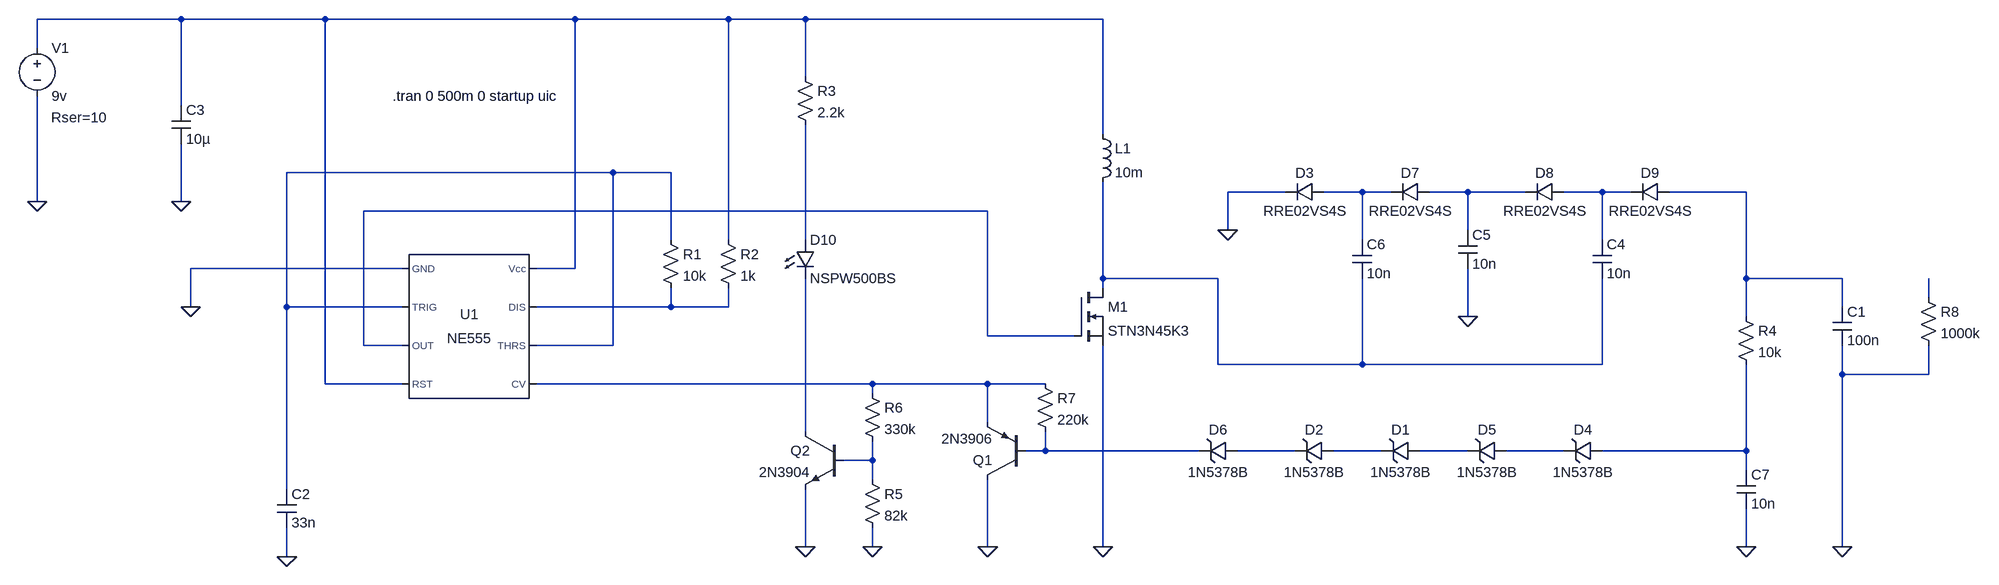
[diagram p0: schematic hv-power-supply-minus-450v.asc]
hv-power-supply-minus-450v.asc, the LTspice schematic file:
Version 4
SHEET 1 3732 680
WIRE -320 -352 -560 -352
WIRE -80 -352 -320 -352
WIRE 336 -352 -80 -352
WIRE 592 -352 336 -352
WIRE 720 -352 592 -352
WIRE 1216 -352 720 -352
WIRE -560 -304 -560 -352
WIRE 720 -256 720 -352
WIRE -320 -208 -320 -352
WIRE 1216 -160 1216 -352
WIRE 400 -96 -144 -96
WIRE 496 -96 400 -96
WIRE 1520 -64 1424 -64
WIRE 1648 -64 1584 -64
WIRE 1696 -64 1648 -64
WIRE 1824 -64 1760 -64
WIRE 1920 -64 1824 -64
WIRE 2048 -64 1984 -64
WIRE 2096 -64 2048 -64
WIRE 2288 -64 2160 -64
WIRE -560 -48 -560 -224
WIRE -320 -48 -320 -144
WIRE 1024 -32 -16 -32
WIRE 1424 0 1424 -64
WIRE 1824 0 1824 -64
WIRE 496 16 496 -96
WIRE 592 16 592 -352
WIRE 720 16 720 -176
WIRE 1648 16 1648 -64
WIRE 2048 16 2048 -64
WIRE 48 64 -304 64
WIRE 336 64 336 -352
WIRE 336 64 272 64
WIRE 1216 80 1216 -80
WIRE 1408 80 1216 80
WIRE 2288 80 2288 -64
WIRE 2448 80 2288 80
WIRE 1216 96 1216 80
WIRE 2592 112 2592 80
WIRE -304 128 -304 64
WIRE -144 128 -144 -96
WIRE 48 128 -144 128
WIRE 496 128 496 96
WIRE 496 128 272 128
WIRE 592 128 592 96
WIRE 592 128 496 128
WIRE 2448 128 2448 80
WIRE 1824 144 1824 64
WIRE 2288 144 2288 80
WIRE 1024 176 1024 -32
WIRE 1168 176 1024 176
WIRE -16 192 -16 -32
WIRE 48 192 -16 192
WIRE 400 192 400 -96
WIRE 400 192 272 192
WIRE 1408 224 1408 80
WIRE 1648 224 1648 80
WIRE 1648 224 1408 224
WIRE 2048 224 2048 80
WIRE 2048 224 1648 224
WIRE 2448 240 2448 192
WIRE 2592 240 2592 192
WIRE 2592 240 2448 240
WIRE -80 256 -80 -352
WIRE 48 256 -80 256
WIRE 832 256 272 256
WIRE 1024 256 832 256
WIRE 1120 256 1024 256
WIRE 832 272 832 256
WIRE 1024 320 1024 256
WIRE 720 336 720 80
WIRE 1120 368 1120 336
WIRE 1120 368 1088 368
WIRE 1376 368 1120 368
WIRE 1536 368 1440 368
WIRE 1680 368 1600 368
WIRE 1824 368 1744 368
WIRE 1984 368 1888 368
WIRE 2288 368 2288 224
WIRE 2288 368 2048 368
WIRE 832 384 832 352
WIRE 832 384 784 384
WIRE 2288 400 2288 368
WIRE 832 416 832 384
WIRE -144 432 -144 128
WIRE 720 528 720 432
WIRE 832 528 832 496
WIRE 1024 528 1024 416
WIRE 1216 528 1216 192
WIRE 2288 528 2288 464
WIRE 2448 528 2448 240
WIRE -144 544 -144 496
FLAG -560 -48 0
FLAG -304 128 0
FLAG 1216 528 0
FLAG 2448 528 0
FLAG -144 544 0
FLAG -320 -48 0
FLAG 720 528 0
FLAG 1424 0 0
FLAG 1824 144 0
FLAG 1024 528 0
FLAG 832 528 0
FLAG 2288 528 0
SYMBOL Misc\\NE555 160 160 R0
SYMATTR InstName U1
SYMBOL voltage -560 -320 R0
WINDOW 123 0 0 Left 0
WINDOW 39 23 132 Left 2
SYMATTR SpiceLine Rser=10
SYMATTR InstName V1
SYMATTR Value 9v
SYMBOL nmos 1168 96 R0
SYMATTR InstName M1
SYMATTR Value STN3N45K3
SYMBOL ind 1200 -176 R0
SYMATTR InstName L1
SYMATTR Value 10m
SYMATTR SpiceLine Ipk=250m Rser=14.6 Rpar=0 Cpar=0
SYMBOL cap 2432 128 R0
SYMATTR InstName C1
SYMATTR Value 100n
SYMATTR SpiceLine Rser=1u Lser=1n Rpar=10G
SYMBOL res 480 0 R0
SYMATTR InstName R1
SYMATTR Value 10k
SYMBOL res 576 0 R0
SYMATTR InstName R2
SYMATTR Value 1k
SYMBOL cap -160 432 R0
SYMATTR InstName C2
SYMATTR Value 33n
SYMBOL cap -336 -208 R0
SYMATTR InstName C3
SYMATTR Value 10µ
SYMBOL zener 2048 352 R90
WINDOW 0 -4 32 VBottom 2
WINDOW 3 36 32 VTop 2
SYMATTR InstName D4
SYMATTR Value 1N5378B
SYMBOL res 2272 128 R0
SYMATTR InstName R4
SYMATTR Value 10k
SYMBOL zener 1888 352 R90
WINDOW 0 -4 32 VBottom 2
WINDOW 3 36 32 VTop 2
SYMATTR InstName D5
SYMATTR Value 1N5378B
SYMBOL diode 1584 -80 R90
WINDOW 0 0 32 VBottom 2
WINDOW 3 32 32 VTop 2
SYMATTR InstName D3
SYMATTR Value RRE02VS4S
SYMBOL cap 1632 16 R0
SYMATTR InstName C6
SYMATTR Value 10n
SYMBOL zener 1744 352 R90
WINDOW 0 -4 32 VBottom 2
WINDOW 3 36 32 VTop 2
SYMATTR InstName D1
SYMATTR Value 1N5378B
SYMBOL zener 1600 352 R90
WINDOW 0 -4 32 VBottom 2
WINDOW 3 36 32 VTop 2
SYMATTR InstName D2
SYMATTR Value 1N5378B
SYMBOL zener 1440 352 R90
WINDOW 0 -4 32 VBottom 2
WINDOW 3 36 32 VTop 2
SYMATTR InstName D6
SYMATTR Value 1N5378B
SYMBOL pnp 1088 416 R180
SYMATTR InstName Q1
SYMATTR Value 2N3906
SYMBOL cap 2032 16 R0
SYMATTR InstName C4
SYMATTR Value 10n
SYMBOL cap 1808 0 R0
SYMATTR InstName C5
SYMATTR Value 10n
SYMBOL diode 1760 -80 R90
WINDOW 0 0 32 VBottom 2
WINDOW 3 32 32 VTop 2
SYMATTR InstName D7
SYMATTR Value RRE02VS4S
SYMBOL diode 1984 -80 R90
WINDOW 0 0 32 VBottom 2
WINDOW 3 32 32 VTop 2
SYMATTR InstName D8
SYMATTR Value RRE02VS4S
SYMBOL diode 2160 -80 R90
WINDOW 0 0 32 VBottom 2
WINDOW 3 32 32 VTop 2
SYMATTR InstName D9
SYMATTR Value RRE02VS4S
SYMBOL npn 784 336 M0
SYMATTR InstName Q2
SYMATTR Value 2N3904
SYMBOL res 704 -272 R0
SYMATTR InstName R3
SYMATTR Value 2.2k
SYMBOL LED 704 16 R0
SYMATTR InstName D10
SYMATTR Value NSPW500BS
SYMBOL res 816 400 R0
SYMATTR InstName R5
SYMATTR Value 82k
SYMBOL res 816 256 R0
SYMATTR InstName R6
SYMATTR Value 330k
SYMBOL cap 2272 400 R0
SYMATTR InstName C7
SYMATTR Value 10n
SYMBOL res 1104 240 R0
SYMATTR InstName R7
SYMATTR Value 220k
SYMBOL res 2576 96 R0
SYMATTR InstName R8
SYMATTR Value 1000k
TEXT 32 -224 Left 2 !.tran 0 500m 0 startup uic

The netlist it stands for:
* hv-power-supply-minus-450v.asc
XU1 0 N002 N007 N001 N012 N002 N011 N001 NE555  ; pins GND TRIG OUT RST CV THRS DIS Vcc
V1 N001 0 9v Rser=10
M1 N009 N007 0 0 STN3N45K3
L1 N001 N009 10m Ipk=250m Rser=14.6 Rpar=0 Cpar=0
C1 N006 0 100n Rser=1u Lser=1n Rpar=10G
R1 N002 N011 10k
R2 N001 N011 1k
C2 N002 0 33n
C3 N001 0 10µ
D4 N019 N018 1N5378B
R4 N006 N019 10k
D5 N018 N017 1N5378B
D3 N003 0 RRE02VS4S
C6 N003 N009 10n
D1 N017 N016 1N5378B
D2 N016 N015 1N5378B
D6 N015 N014 1N5378B
Q1 0 N014 N012 0 2N3906
C4 N005 N009 10n
C5 N004 0 10n
D7 N004 N003 RRE02VS4S
D8 N005 N004 RRE02VS4S
D9 N006 N005 RRE02VS4S
Q2 N013 N020 0 0 2N3904
R3 N001 N008 2.2k
D10 N008 N013 NSPW500BS
R5 N020 0 82k
R6 N012 N020 330k
C7 N019 0 10n
R7 N012 N014 220k
R8 N010 0 1000k
.model D D
.lib standard.dio
.model NPN NPN
.model PNP PNP
.lib standard.bjt
.model NMOS NMOS
.model PMOS PMOS
.lib standard.mos
.tran 0 500m 0 startup uic
.lib NE555.sub
.backanno
.end